# EAGLE design train (EAGLE 7.3.0)
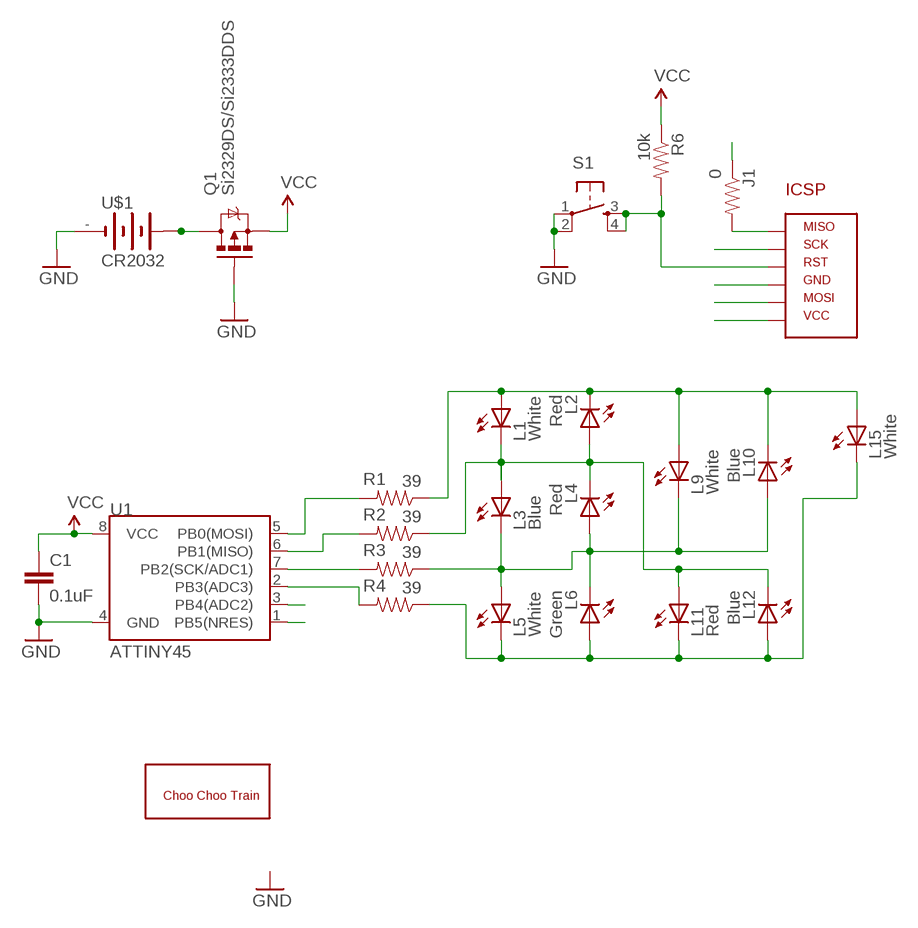
[diagram p0: schematic, sheet 1]

## Parts
C1  0.1uF  CAP0805  [0805]
J1  0  RESISTOR0805-RES  [0805]
L1  White  LED0805-RED  [LED-0805-RED]
L2  Red  LED0805-RED  [LED-0805-RED]
L3  Blue  LED0805-RED  [LED-0805-RED]
L4  Red  LED0805-RED  [LED-0805-RED]
L5  White  LED0805-RED  [LED-0805-RED]
L6  Green  LED0805-BLUE  [LED-0805-BLUE]
L9  White  LED0805-YELLOW  [LED-0805-YELLOW]
L10  Blue  LED0805-BLUE  [LED-0805-BLUE]
L11  Red  LED0805-BLUE  [LED-0805-BLUE]
L12  Blue  LED0805-RED  [LED-0805-RED]
L15  White  LED0805-BLUE  [LED-0805-BLUE]
Q1  Si2329DS/Si2333DDS  MOSFET_P_CH  [SOT23-3]
R1  39  RESISTOR0805-RES  [0805]
R2  39  RESISTOR0805-RES  [0805]
R3  39  RESISTOR0805-RES  [0805]
R4  39  RESISTOR0805-RES  [0805]
R6  10k  RESISTOR0805-RES  [0805]
S1  TAC_SWITCHSMD  [TACTILE_SWITCH_SMD]
U1  ATTINY45  [SO08-EIAJ]
U$1  CR2032  BAT-HLD-001  [BAT-HLD-001]
U$2  AVR_ICSP_6P1X6  [AVR_ICSP_1X6_SMD]
U$3  5X6_CHOOCHOOTRAIN  [CHOOCHOO]

## Nets
GND: C1.2 Q1.1(G) S1.1 S1.2 U1.4(GND) U$1.- U$2.P6(GND)
L12: L1.C L2.A L3.A L4.C L11.A L12.C R2.1
MISO: J1.1 R2.2 U1.6(PB1(MISO))
MOSI: R1.2 U1.5(PB0(MOSI)) U$2.P4(MOSI)
N$1: Q1.3(D) U$1.+@1(+) U$1.+@2(+)
N$2: U1.3(PB4(ADC2))
N$3: L3.C L4.A L5.A L6.C L9.C L10.A R3.1
N$4: R4.2 U1.2(PB3(ADC3))
N$6: L1.A L2.C L9.A L10.C L15.A R1.1
N$8: J1.2 U$2.P5(MISO)
N$10: L5.C L6.A L11.C L12.A L15.C R4.1
RST: R6.2 S1.3 S1.4 U1.1(PB5(NRES)) U$2.P3(RST)
SCK: R3.2 U1.7(PB2(SCK/ADC1)) U$2.P2(SCK)
VCC: C1.1 Q1.2(S) R6.1 U1.8(VCC) U$2.P1(VCC)

## Notes on the sheet
- ICSP

## Library data of the parts
C1 = SparkFun-Capacitors:CAP: Capacitor Standard 0603 ceramic capacitor, and 0.1" leaded capacitor.
J1 = SparkFun-Passives:RESISTOR: Resistor Basic schematic elements and footprints for 0603, 1206, and PTH resistors.
L1-L6 L9-L12 L15 = My Custom Parts:LED
Q1 = My Custom Parts:MOSFET_P_CH
R1-R4 R6 = SparkFun-Resistors:RESISTOR: Resistor Basic schematic elements and footprints for 0603, 1206, and PTH resistors.
S1 = My Custom Parts:TAC_SWITCH: Momentary Switch Button commonly used for reset or general input. Spark Fun Electronics SKU : COM-00097 SMT- SWCH-08247; PROD_ID: SWCH-08247
U1 = SparkFun:ATTINY45: Atmel ATTiny45
U$1 = My Custom Parts:BAT-HLD-001
U$2 = AVR_ICSP_Footprints:AVR_ICSP_6P
U$3 = BMPs:5X6_CHOOCHOOTRAIN

## Board
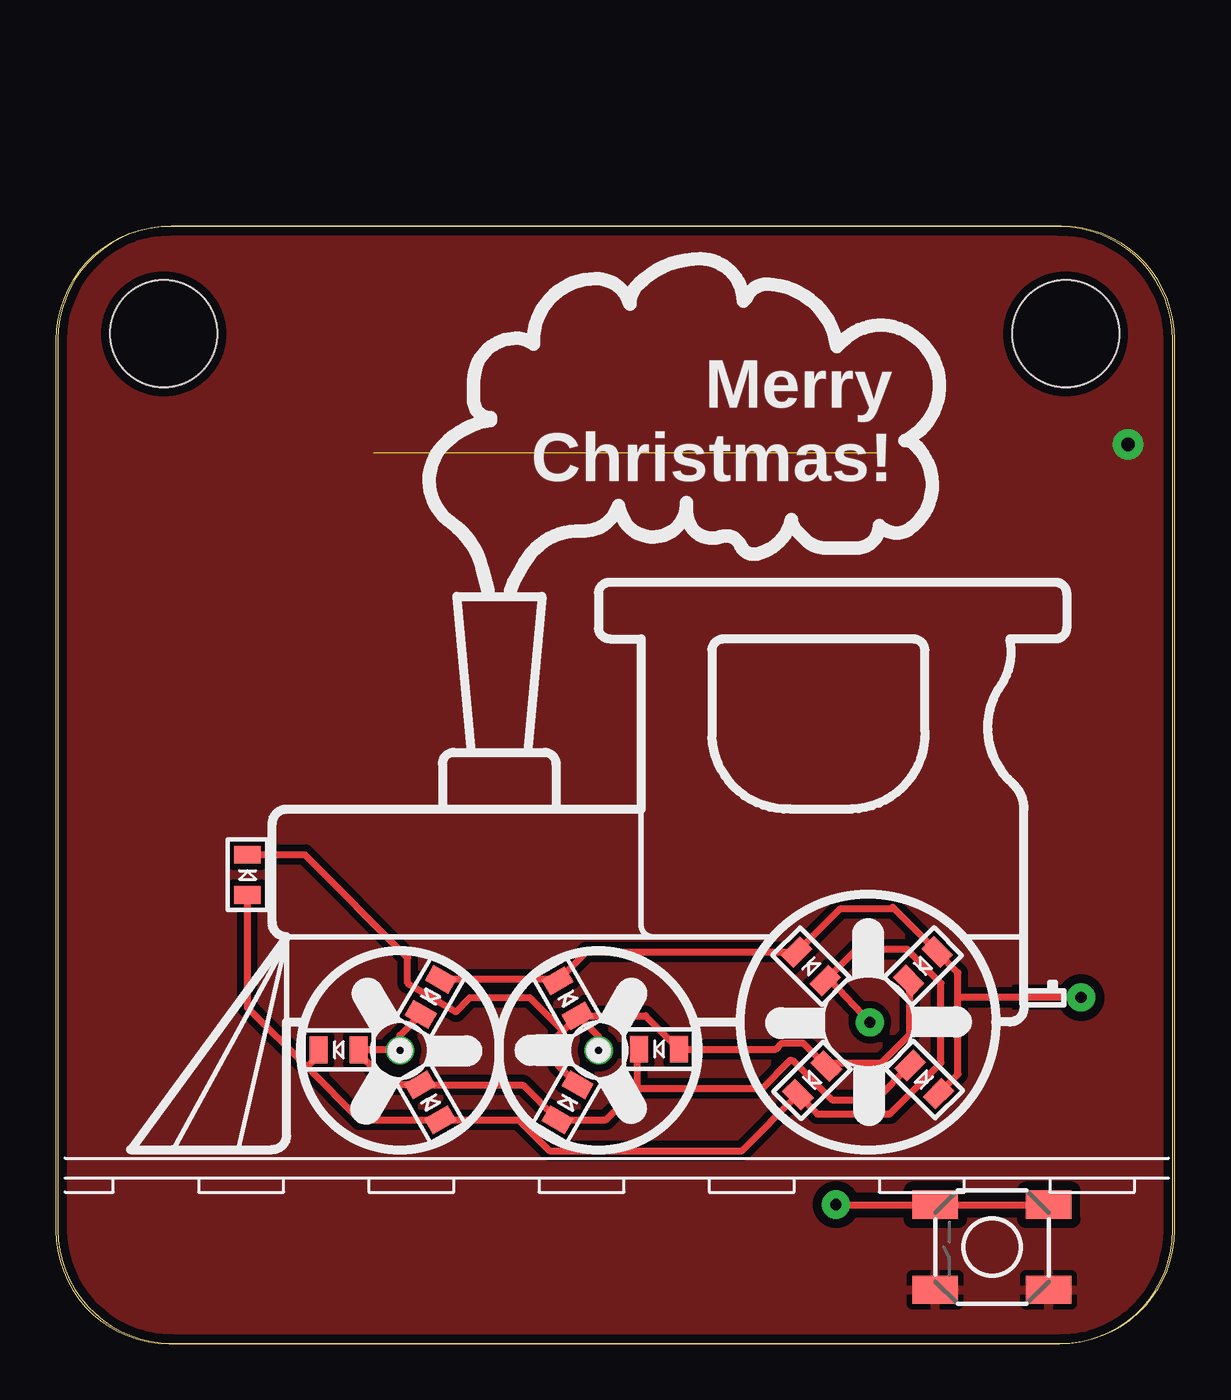
[diagram p1: board, top side]
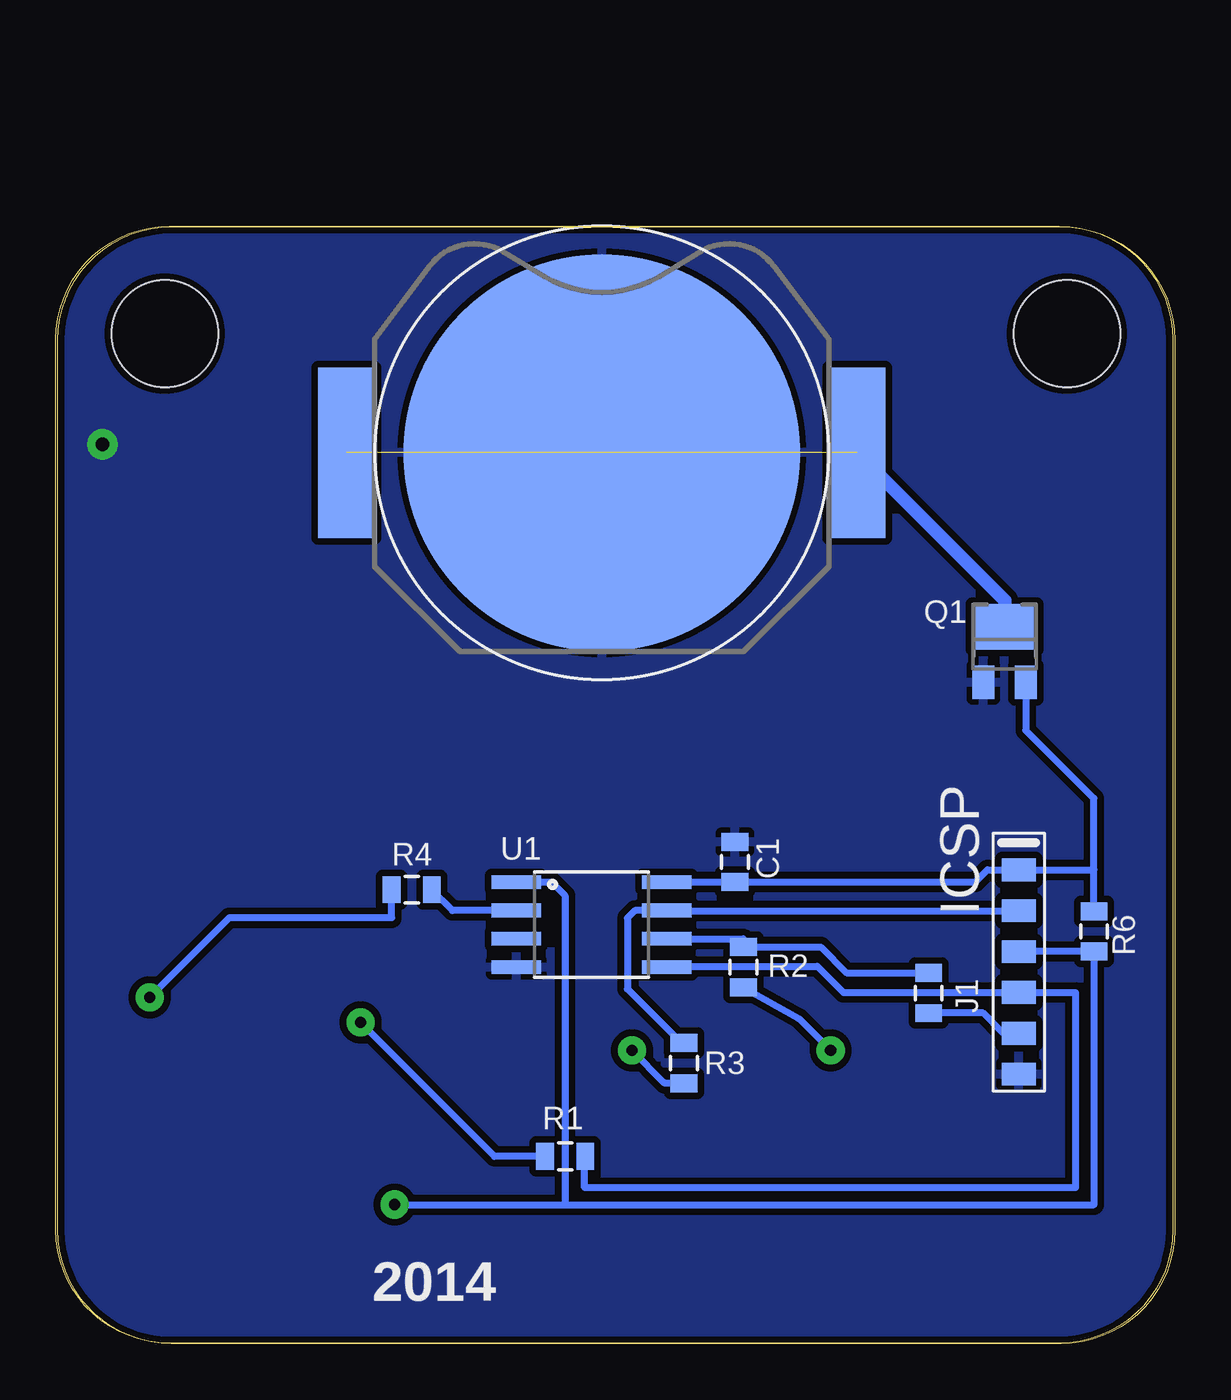
[diagram p2: board, bottom side, seen from below]

Size 50 x 50 mm. Coordinates in mm from the lower left corner, seen from the top.
Outline: 0,44.92 0,5.08 arc90 5.08,0 44.92,0 arc90 50,5.08 50,44.92 arc90 44.92,50 5.08,50 arc90 0,44.92
Copper layers (1*16): Top 0.035mm / dielectric 1.5mm / Bottom 0.035mm
Design rules "tim *": minimum track width 10mil, minimum drill 32mil, track to track 12mil, track to pad 12mil, pad to pad 12mil, via to via 12mil, smd to smd 8mil, copper to edge 12mil, drill to drill 12mil, minimum pad ring 0.6mm, minimum via ring 15mil, stop-mask expansion 0mil, vias tented up to drill 0mil, thermal gap 10mil
Holes 4.76 mm at 4.83,45.21 45.21,45.21

### Footprints (pad centres in the part's own frame; a part is rotated, then mirrored left to right if it is on the bottom)
0805 = smd 0.8 x 1.2: 1 -0.9,0; 2 0.9,0
LED-0805-RED = smd 0.8 x 1.2: A -0.9,0; C 0.9,0
LED-0805-BLUE = smd 0.8 x 1.2: A -0.9,0; C 0.9,0
LED-0805-YELLOW = smd 0.8 x 1.2: A -0.9,0; C 0.9,0
SOT23-3 = smd 1 x 1.5: 1 -0.95,-1.254; 2 0.95,-1.254 | smd 2.9 x 2.05: 3 0,1.227
TACTILE_SWITCH_SMD = smd 2.032 x 1.27: 1 -2.54,1.905; 2 2.54,1.905; 3 -2.54,-1.905; 4 2.54,-1.905
SO08-EIAJ = smd 0.61 x 2.21: 1 -1.905,-3.378; 2 -0.635,-3.378; 3 0.635,-3.378; 4 1.905,-3.378; 5 1.905,3.353; 6 0.635,3.353; 7 -0.635,3.353; 8 -1.905,3.353
BAT-HLD-001 = smd 2.54 x 7.62: +@1 -11.43,0; +@2 11.43,0 | smd 17.78 x 17.78: - 0,0
AVR_ICSP_1X6_SMD = smd 1.016 x 1.524: P1 9.144,0; P2 7.315,0; P3 5.486,0; P4 3.658,0; P5 1.829,0; P6 0,0

### Placement (x,y rotation side)
C1  19.68,21.56 90 bottom
J1  11.02,15.7 270 bottom
L1  16.76,10.8 120 top
L2  12.66,13.15 180 top
L3  22.91,10.81 60 top
L4  27,13.18 180 top
L5  22.91,15.45 120 top
L6  38.82,16.9 225 top
L9  8.57,20.99 90 top
L10  33.86,11.79 225 top
L11  38.87,11.82 315 top
L12  16.79,15.52 240 top
L15  33.81,16.89 135 top
Q1  7.62,30.86 0 bottom
R1  27.29,8.38 0 bottom
R2  19.31,16.85 90 bottom
R3  21.98,12.56 90 bottom
R4  34.16,20.32 0 bottom
R6  3.62,18.45 270 bottom
S1  41.91,4.32 180 top
U1  26.1,18.76 270 bottom
U$1  25.65,39.88 180 bottom
U$2  6.99,12.06 90 bottom
U$3  24.42,25.32 0 top

### Tracks (layer width: path | path; a pad name or v marks a point on that pad's centre or on a via)
GND  (via drill 0.6)
  other vias: 48.01,40.26
  pour Top (isolate 0.406): -1.14,50.93 -1.14,-1.14 52.32,-1.14 52.32,50.93
  pour Bottom (isolate 0.305): -1.91,51.69 52.07,51.56 51.82,-1.14 -2.16,-1.02
L12  (via drill 0.5)
  Top 0.305: 26.04,11.43 24.63,10.03 L3.A 20.91,11.58 L1.C 14.97,11.58 13.56,12.98 L2.A 15.39,13.15 v15.4,13.13 15.4,13.81 L12.C | 26.04,11.43 26.04,13.12 L4.C | 26.04,11.43 31.62,11.43 32.89,12.7 33.02,12.65 34.75,10.92 36.7,10.92 L11.A
  Bottom 0.305: R2.1 16.83,14.56 v15.4,13.13
MISO
  Bottom 0.305: U1.6 19.31,18.12 R2.2 15.85,17.75 14.69,16.6 J1.1
MOSI
  Bottom 0.305: 7.25,15.46 U$2.P4 | U$2.P4 4.45,15.72 4.45,6.99 26.42,6.99 26.42,8.38 R1.2 | U$2.P4 14.83,15.72 16,16.89 22.71,16.89 U1.5 22.17,16.85 22.16,16.84
N$1  (1 unrouted)
  Bottom 0.61: Q1.3 7.62,33.27 U$1.+@1
N$2
  Bottom 0.305: U1.3 29.53,18.17
N$3  (via drill 0.5)
  Top 0.305: L3.C 22.48,12.47 22.48,13.79 22.7,14.01 | 22.7,14.01 L5.A | L5.A 26.41,14.67 L4.A 32.23,13.18 32.51,13.46 33.45,13.46 L10.A 34.49,12.57 36.95,12.57 38.23,13.84 38.23,16.22 L6.C | L5.A 24.31,13.73 v24.31,13.13 | L9.C 11.13,21.89 15.75,17.27 15.75,16.13 17.91,14.86 18.54,15.49 21.21,15.49 22.7,14.01 | 22.7,14.01
  Bottom 0.305: R3.1 22.84,11.66 v24.31,13.13
N$4
  Bottom 0.305: U1.2 32.34,19.39 R4.2
N$6  (via drill 0.5)
  Top 0.305: L9.A 8.57,15.05 11.24,12.38 | 11.24,12.38 13.6,10.02 L1.A 20.72,10.02 22.1,8.64 30.71,8.64 L10.C 34.08,10.29 37.34,10.29 39.62,12.57 39.62,16.13 38.1,17.65 35.84,17.65 L15.A 34.67,16.25 v36.45,14.38 | L2.C 11.76,12.9 11.24,12.38
  Bottom 0.305: R1.1 30.45,8.38 v36.45,14.38
N$8
  Bottom 0.305: U$2.P5 7.67,13.89 8.57,14.8 J1.2
N$10  (via drill 0.5)
  Top 0.305: L11.C 40.39,12.06 40.39,15.42 | 40.39,15.42 40.39,16.61 L6.A 37.51,19.48 | 37.51,19.48 37.47,19.53 | 37.51,19.48 35.12,19.48 L15.C 23.75,17.53 L5.C 22.39,16.3 L12.A | v45.9,15.49 40.46,15.49 40.39,15.42
  Bottom 0.305: R4.1 35.06,19.06 42.33,19.06 v45.9,15.49
N$11
  pour Top: 5.71,24.26 5.71,7.87 42.67,7.87 42.67,24.26
N$12
  pour Bottom: 2.16,22.23 2.16,13.72 26.04,13.72 26.04,22.23
RST  (via drill 0.5)
  Top 0.305: v34.92,6.22 S1.4 S1.3
  Bottom 0.305: U1.1 27.9,20.66 27.3,20.07 27.3,6.22 | v34.92,6.22 27.3,6.22 | 27.3,6.22 3.62,6.22 R6.2 U$2.P3
SCK
  Bottom 0.305: U$2.P2 22.73,19.38 U1.7 24.17,19.39 24.51,19.05 24.51,15.88 22.1,13.46 R3.2
VCC
  Bottom 0.305: Q1.2 6.67,27.46 3.62,24.41 3.62,21.21 | R6.1 3.62,21.21 | 3.62,21.21 U$2.P1 8.38,21.21 8.93,20.66 C1.1 U1.8

### Text on the board
tPlace: Merry / Christmas!
bPlace: 2014
bNames: ICSP